# Altium schematic sheet Digital Port K State LED Inducator.SchDoc: PORT State LED Inducator
size A3
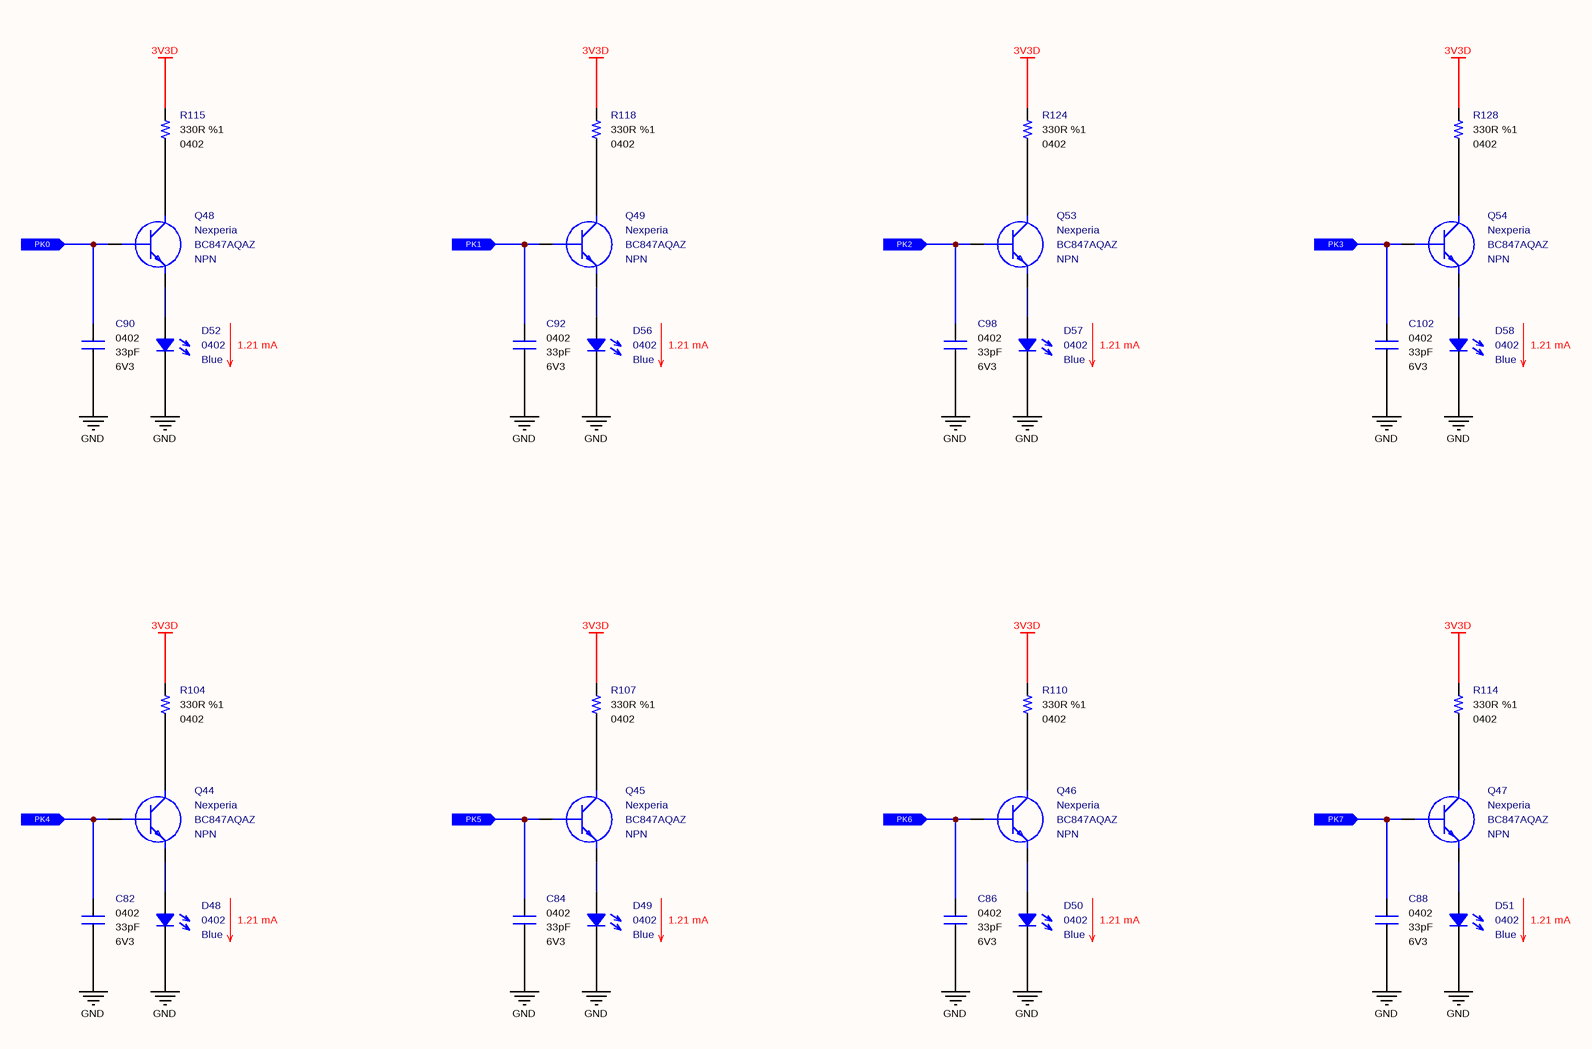
[diagram p0: Digital Port K State LED Inducator.SchDoc]

## Parts
C82  value 33pF  Case: 0402  Voltage: 6V3  [CAPACITOR_0402]  (hidden comment: Multilayer Ceramic Capacitor)
C84  value 33pF  Case: 0402  Voltage: 6V3  [CAPACITOR_0402]  (hidden comment: Multilayer Ceramic Capacitor)
C86  value 33pF  Case: 0402  Voltage: 6V3  [CAPACITOR_0402]  (hidden comment: Multilayer Ceramic Capacitor)
C88  value 33pF  Case: 0402  Voltage: 6V3  [CAPACITOR_0402]  (hidden comment: Multilayer Ceramic Capacitor)
C90  value 33pF  Case: 0402  Voltage: 6V3  [CAPACITOR_0402]  (hidden comment: Multilayer Ceramic Capacitor)
C92  value 33pF  Case: 0402  Voltage: 6V3  [CAPACITOR_0402]  (hidden comment: Multilayer Ceramic Capacitor)
C98  value 33pF  Case: 0402  Voltage: 6V3  [CAPACITOR_0402]  (hidden comment: Multilayer Ceramic Capacitor)
C102  value 33pF  Case: 0402  Voltage: 6V3  [CAPACITOR_0402]  (hidden comment: Multilayer Ceramic Capacitor)
D48  Case: 0402  Color: Blue  [LED_0402]  (hidden comment: SMD LED (Blue))
D49  Case: 0402  Color: Blue  [LED_0402]  (hidden comment: SMD LED (Blue))
D50  Case: 0402  Color: Blue  [LED_0402]  (hidden comment: SMD LED (Blue))
D51  Case: 0402  Color: Blue  [LED_0402]  (hidden comment: SMD LED (Blue))
D52  Case: 0402  Color: Blue  [LED_0402]  (hidden comment: SMD LED (Blue))
D56  Case: 0402  Color: Blue  [LED_0402]  (hidden comment: SMD LED (Blue))
D57  Case: 0402  Color: Blue  [LED_0402]  (hidden comment: SMD LED (Blue))
D58  Case: 0402  Color: Blue  [LED_0402]  (hidden comment: SMD LED (Blue))
Q44  Manufacturer_Name: Nexperia  Manufacturer_Part_Number: BC847AQAZ  Polarity: NPN  [SOT1215]  (hidden comment: Bipolar NPN Transistors)
Q45  Manufacturer_Name: Nexperia  Manufacturer_Part_Number: BC847AQAZ  Polarity: NPN  [SOT1215]  (hidden comment: Bipolar NPN Transistors)
Q46  Manufacturer_Name: Nexperia  Manufacturer_Part_Number: BC847AQAZ  Polarity: NPN  [SOT1215]  (hidden comment: Bipolar NPN Transistors)
Q47  Manufacturer_Name: Nexperia  Manufacturer_Part_Number: BC847AQAZ  Polarity: NPN  [SOT1215]  (hidden comment: Bipolar NPN Transistors)
Q48  Manufacturer_Name: Nexperia  Manufacturer_Part_Number: BC847AQAZ  Polarity: NPN  [SOT1215]  (hidden comment: Bipolar NPN Transistors)
Q49  Manufacturer_Name: Nexperia  Manufacturer_Part_Number: BC847AQAZ  Polarity: NPN  [SOT1215]  (hidden comment: Bipolar NPN Transistors)
Q53  Manufacturer_Name: Nexperia  Manufacturer_Part_Number: BC847AQAZ  Polarity: NPN  [SOT1215]  (hidden comment: Bipolar NPN Transistors)
Q54  Manufacturer_Name: Nexperia  Manufacturer_Part_Number: BC847AQAZ  Polarity: NPN  [SOT1215]  (hidden comment: Bipolar NPN Transistors)
R104  value 330R  Tolerance: %1  Case: 0402  [RESISTOR_0402]  (hidden comment: Thick Film Resistor)
R107  value 330R  Tolerance: %1  Case: 0402  [RESISTOR_0402]  (hidden comment: Thick Film Resistor)
R110  value 330R  Tolerance: %1  Case: 0402  [RESISTOR_0402]  (hidden comment: Thick Film Resistor)
R114  value 330R  Tolerance: %1  Case: 0402  [RESISTOR_0402]  (hidden comment: Thick Film Resistor)
R115  value 330R  Tolerance: %1  Case: 0402  [RESISTOR_0402]  (hidden comment: Thick Film Resistor)
R118  value 330R  Tolerance: %1  Case: 0402  [RESISTOR_0402]  (hidden comment: Thick Film Resistor)
R124  value 330R  Tolerance: %1  Case: 0402  [RESISTOR_0402]  (hidden comment: Thick Film Resistor)
R128  value 330R  Tolerance: %1  Case: 0402  [RESISTOR_0402]  (hidden comment: Thick Film Resistor)

## Ports
PK0 (in), PK1 (in), PK2 (in), PK3 (in), PK4 (in), PK5 (in), PK6 (in), PK7 (in)

## Nets
3V3D: R104.2 R107.2 R110.2 R114.2 R115.2 R118.2 R124.2 R128.2
GND: C82.2 C84.2 C86.2 C88.2 C90.2 C92.2 C98.2 C102.2 D48.1 D49.1 D50.1 D51.1 D52.1 D56.1 D57.1 D58.1
PK0: C90.1 Q48.1(B) ; port PK0
PK1: C92.1 Q49.1(B) ; port PK1
PK2: C98.1 Q53.1(B) ; port PK2
PK3: C102.1 Q54.1(B) ; port PK3
PK4: C82.1 Q44.1(B) ; port PK4
PK5: C84.1 Q45.1(B) ; port PK5
PK6: C86.1 Q46.1(B) ; port PK6
PK7: C88.1 Q47.1(B) ; port PK7
NetD48_2: D48.2 Q44.2(E)
NetD49_2: D49.2 Q45.2(E)
NetD50_2: D50.2 Q46.2(E)
NetD51_2: D51.2 Q47.2(E)
NetD52_2: D52.2 Q48.2(E)
NetD56_2: D56.2 Q49.2(E)
NetD57_2: D57.2 Q53.2(E)
NetD58_2: D58.2 Q54.2(E)
NetQ44_3: Q44.3(C) R104.1
NetQ45_3: Q45.3(C) R107.1
NetQ46_3: Q46.3(C) R110.1
NetQ47_3: Q47.3(C) R114.1
NetQ48_3: Q48.3(C) R115.1
NetQ49_3: Q49.3(C) R118.1
NetQ53_3: Q53.3(C) R124.1
NetQ54_3: Q54.3(C) R128.1

## Notes on the sheet
- 1.21 mA
- Title
- Size:
- Date:
- A3
- Number:
- Time:
- Revision:
- Sheet
- of
- File:

## Library data of the parts
C82 C84 C86 C88 C90 C92 C98 C102 = Capacitor - 33pF [0402-6V3]: Capacitor - 33pF [0402] (Ceramic); Manufacturer Name: Kemet; Manufacturer Part Number: C0402C330J9RACAUTO; Dielectric: X7R; Tolerance: 10%; Height: 0.5mm; Maximum Operating Temperature: +125; Minimum Operating Temperature: -55; ROHS: Yes; ComponentLink1Description: DataSheet; ComponentLink1URL: https://api.kemet.com/component-edge/download/datasheet/C0402C330J9RACAUTO.pdf; ComponentLink2Description: Mouser; ComponentLink2URL: https://www.mouser.com/Search/Refine.aspx?Keyword=80-C0402C330J9RAUTO; Supplier 1: Mouser; Supplier Part Number 1: 80-C0402C330J9RAUTO; Mouser Part Number: 80-C0402C330J9RAUTO
D48-D52 D56-D58 = Diode - LED (0402-Blue): Standard LEDs - SMD PICOLEDTM;BLUE LED; 25M @ 5MA; Manufacturer_Name: ROHM Semiconductor; Manufacturer_Part_Number: SMLP13BC8TT86; Mouser_Part_Number: 755-SMLP13BC8TT86; ROHS: Yes; ComponentLink1Description: DataSheet; ComponentLink1URL: https://d1d2qsbl8m0m72.cloudfront.net/en/products/databook/datasheet/opto/led/chip_mono/sml-p1-e.pdf; ComponentLink2Description: Mouser; ComponentLink2URL: https://www.mouser.com.tr/ProductDetail/ROHM-Semiconductor/SMLP13BC8TT86?qs=%2Fha2pyFaduidYDgXFKL%252BNZwCVZNUI4FlyPWWbVDx1b6ABmzS%252BS2f0w%3D%3D; Supplier 1: Mouser; Supplier 2: Digi-Key; Supplier Part Number 1: 755-SMLP13BC8TT86; Supplier Part Number 2: 846-1112-1-ND
Q44-Q49 Q53 Q54 = Transistor - BC847: Bipolar Transistors - BJT BC847AQA/DFN1010D-3/REEL 7" Q2; Mouser_Part_Number: 771-BC847AQAZ; ComponentLink1Description: DataSheet; ComponentLink1URL: https://www.mouser.com.tr/datasheet/2/916/BC847XQA_SER-1598405.pdf; ComponentLink2Description: Mouser; ComponentLink2URL: https://www.mouser.com.tr/ProductDetail/Nexperia/BC847AQAZ?qs=%2Fha2pyFaduhKMCPKNtQimeJpXTw9z4AqURd2YARs8DVICZNv3AT9Dw%3D%3D; Case: DFN-1010D-3; Supplier 1: Mouser; Supplier 2: Digi-Key; Supplier Part Number 1: 771-BC847AQAZ; Supplier Part Number 2: 1727-2545-1-ND
R104 R107 R110 R114 R115 R118 R124 R128 = Resistor - 330R: Thick Film Resistors - SMD 1/16 W 330 Ohm 1%; Manufacturer Name: Vishay; Manufacturer Part Number: CRCW0402330RFKED; Height: 0.4mm; ComponentLink1Description: DataSheet; ComponentLink1URL: https://www.mouser.com.tr/datasheet/2/427/dcrcwe3-1762152.pdf; ComponentLink2Description: Mouser; ComponentLink2URL: https://www.mouser.com.tr/ProductDetail/Vishay-Dale/CRCW0402330RFKED?qs=sGAEpiMZZMu61qfTUdNhG2DpbjADlD3GGS6SwBlLi5Q%3D; Supplier 1: Mouser; Supplier 2: Digi-Key; Supplier Part Number 2: 541-330LCT-ND; Supplier Part Number 1: 71-CRCW0402-330-E3; Mouser Part Number: 71-CRCW0402-330-E3